# Altium schematic sheet 06_adc.SchDoc: KART : ADC
size A4; DrawnBy: JNieto; DocumentNumber: 4; Revision: 1.0; SheetNumber: 6; SheetTotal: 10; Version: V 1.0.0
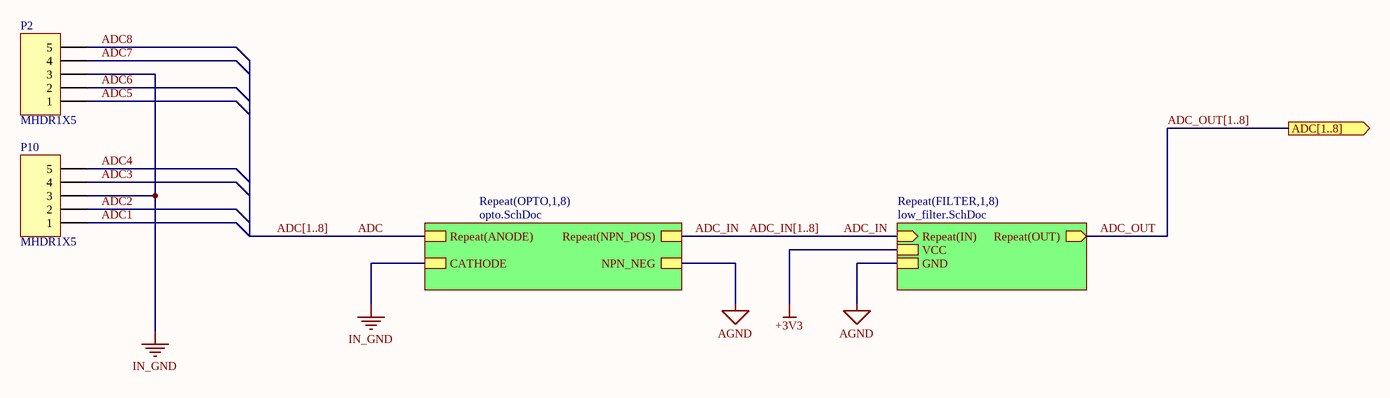
[diagram p0: 06_adc.SchDoc]

## Parts
P2  MHDR1X5  [MHDR1X5]
P10  MHDR1X5  [MHDR1X5]

## Sub-sheets
Repeat(FILTER,1,8) = low_filter.SchDoc: VCC, GND, Repeat(IN) (in), Repeat(OUT) (out)
Repeat(OPTO,1,8) = opto.SchDoc: NPN_NEG, Repeat(NPN_POS), CATHODE, Repeat(ANODE)

## Ports
ADC[1..8] (out)

## Nets
+3V3: sheet Repeat(FILTER,1,8)/VCC
AGND: sheet Repeat(OPTO,1,8)/NPN_NEG, sheet Repeat(FILTER,1,8)/GND
IN_GND: P2.3 P10.3 ; sheet Repeat(OPTO,1,8)/CATHODE
ADC: sheet Repeat(OPTO,1,8)/Repeat(ANODE)
ADC1: P10.1
ADC2: P10.2
ADC3: P10.4
ADC4: P10.5
ADC5: P2.1
ADC6: P2.2
ADC7: P2.4
ADC8: P2.5
ADC_IN: sheet Repeat(OPTO,1,8)/Repeat(NPN_POS), sheet Repeat(FILTER,1,8)/Repeat(IN)
ADC_OUT: sheet Repeat(FILTER,1,8)/Repeat(OUT)

## Buses and harness runs
bus ADC[1..8]
bus ADC_IN[1..8]
bus ADC_OUT[1..8] = port ADC[1..8]

## Library data of the parts
P2 P10 = MHDR1X5: Header, 5-Pin; LatestRevisionDate: 17-Jul-2002; LatestRevisionNote: Re-released for DXP Platform.; Publisher: Altium Limited